# EAGLE design PIC18F44K22 KONTROL KART (EAGLE 9.6.2)
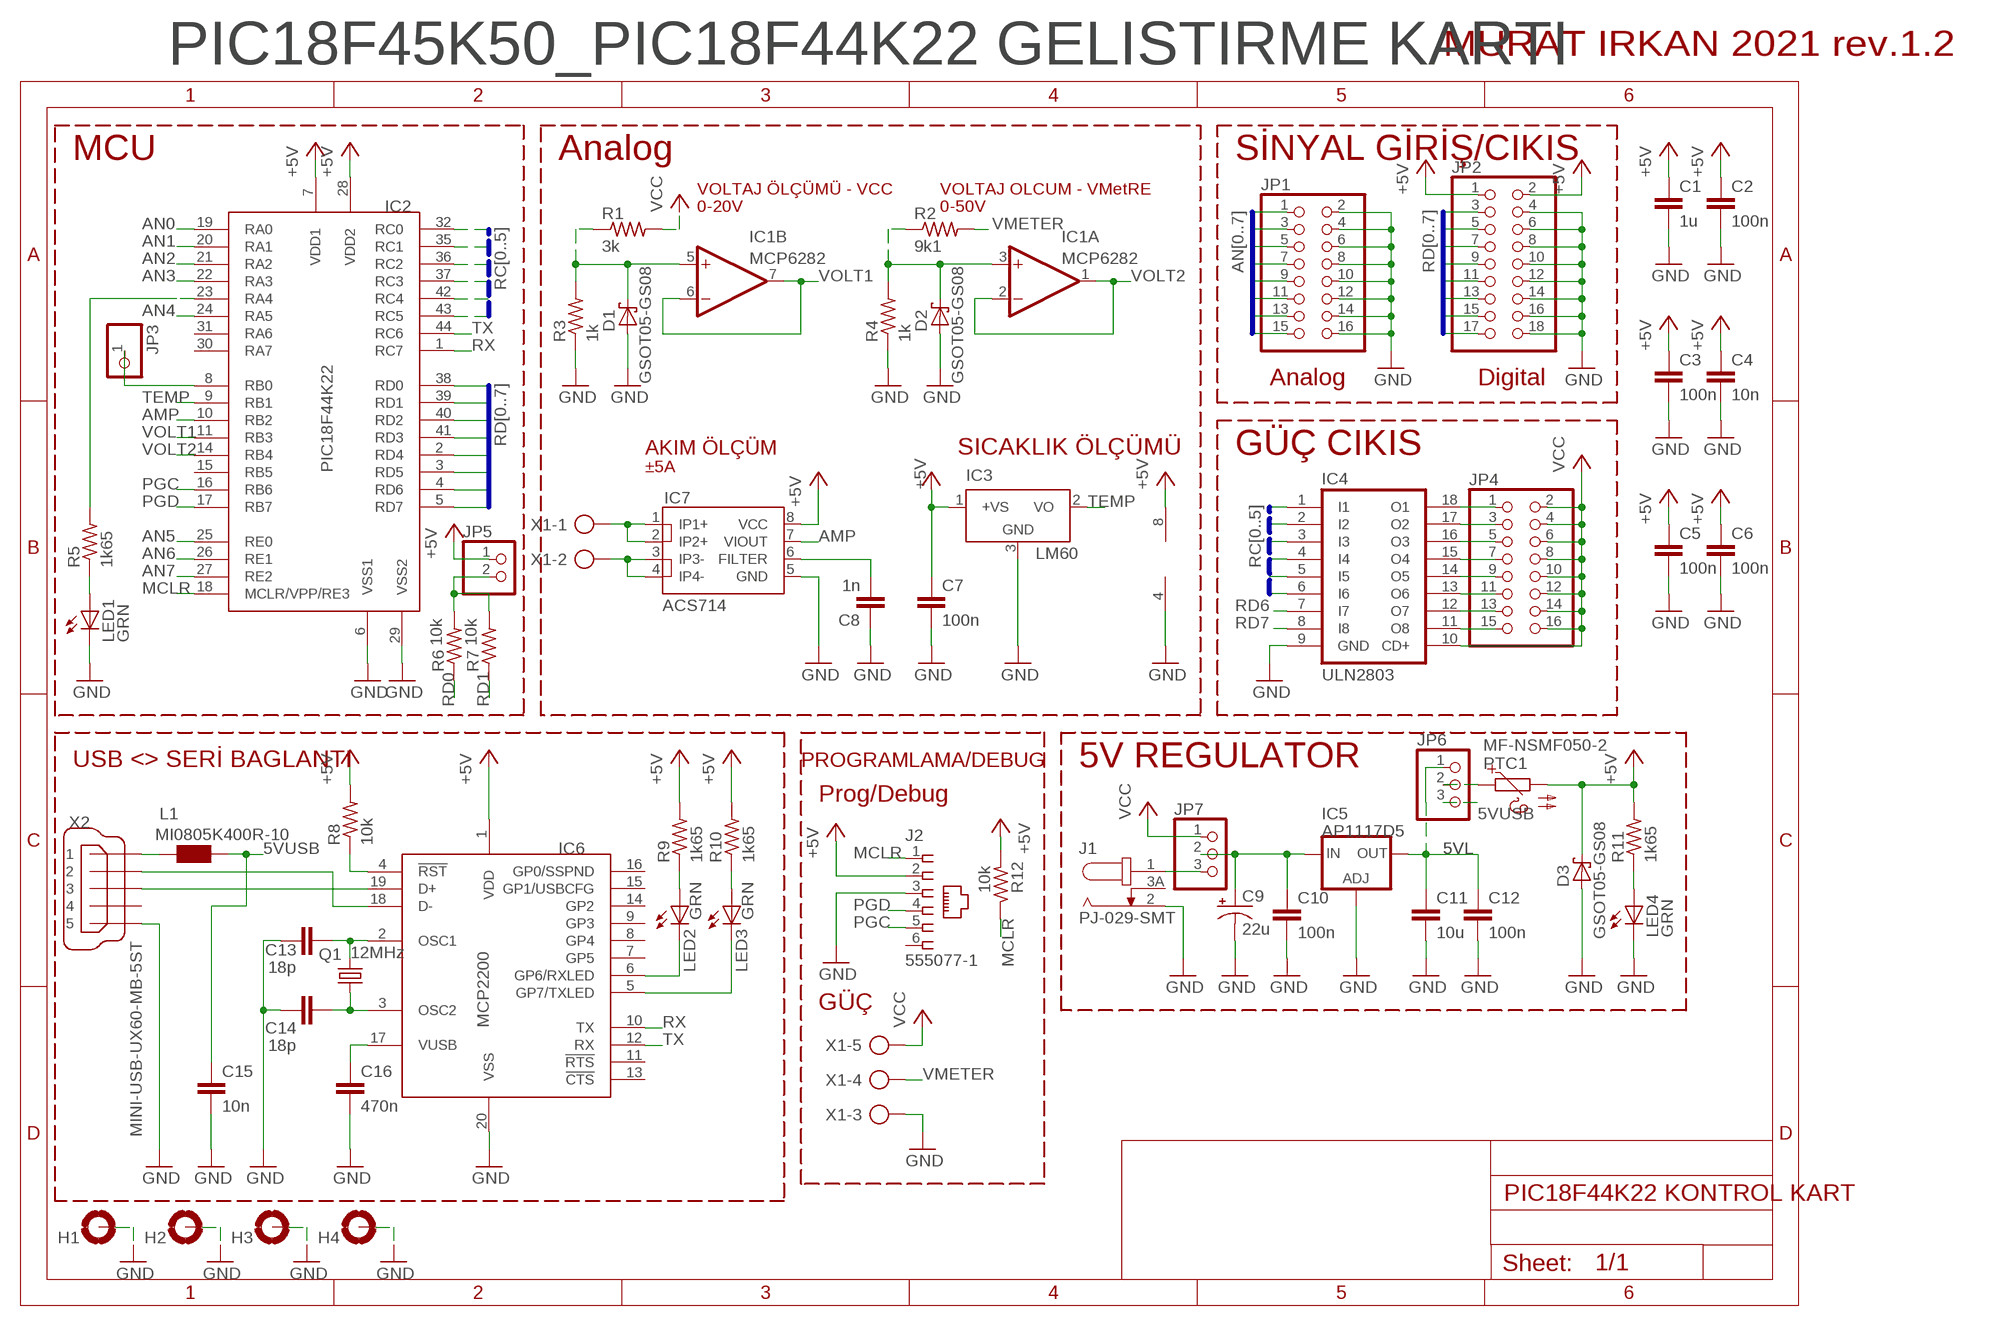
[diagram p0: schematic, sheet 1]

## Parts
C1  1u  C-EUC0603  [C0603]
C2  100n  C-EUC0603  [C0603]
C3  100n  C-EUC0603  [C0603]
C4  10n  C-EUC0603  [C0603]
C5  100n  C-EUC0603  [C0603]
C6  100n  C-EUC0603  [C0603]
C7  100n  C-EUC0603  [C0603]
C8  1n  C-EUC0603  [C0603]
C9  22u  CPOL-US153CLV-0505  [153CLV-0505]
C10  100n  C-EUC0603  [C0603]
C11  10u  C-EUC0805  [C0805]
C12  100n  C-EUC0603  [C0603]
C13  18p  C-EUC0603  [C0603]
C14  18p  C-EUC0603  [C0603]
C15  10n  C-EUC0603  [C0603]
C16  470n  C-EUC0603  [C0603]
D1  GSOT05-GS08  BAS70  [SOT23]
D2  GSOT05-GS08  BAS70  [SOT23]
D3  GSOT05-GS08  BAS70  [SOT23]
H1  MOUNT-PAD-ROUND3.2  [3,2-PAD]
H2  MOUNT-PAD-ROUND3.2  [3,2-PAD]
H3  MOUNT-PAD-ROUND3.2  [3,2-PAD]
H4  MOUNT-PAD-ROUND3.2  [3,2-PAD]
IC1  MCP6282  MCP602SN  [SO08]
IC2  PIC18F44K22  [TQFP44]
IC3  LM60  LM50  [SOT23]
IC4  ULN2803  [SO18]
IC5  AP1117D5  LD117ADT33TR  [DPACK]
IC6  MCP2200  [SSOP20]
IC7  ACS714  ACS712  [SO08]
J1  PJ-029-SMT  [SMT]
J2  555077-1  [555077-1]
JP1  PINHD-2X8  [2X08]
JP2  PINHD-2X9  [2X09]
JP3  PINHD-1X1  [1X01]
JP4  PINHD-2X8  [2X08]
JP5  PINHD-1X2  [1X02]
JP6  PINHD-1X3  [1X03]
JP7  PINHD-1X3  [1X03]
L1  MI0805K400R-10  WE-CBF_0805  [0805]
LED1  GRN  LEDCHIPLED_0603  [CHIPLED_0603]
LED2  GRN  LEDCHIPLED_0603  [CHIPLED_0603]
LED3  GRN  LEDCHIPLED_0603  [CHIPLED_0603]
LED4  GRN  LEDCHIPLED_0603  [CHIPLED_0603]
PTC1  MF-NSMF050-2  GENERIC_1206  [1206]
Q1  12MHz  CRYSTALHC49UP  [HC49UP]
R1  3k  R-US_R0603  [R0603]
R2  9k1  R-US_R0603  [R0603]
R3  1k  R-US_R0603  [R0603]
R4  1k  R-US_R0603  [R0603]
R5  1k65  R-US_R0603  [R0603]
R6  10k  R-US_R0603  [R0603]
R7  10k  R-US_R0603  [R0603]
R8  10k  R-US_R0603  [R0603]
R9  1k65  R-US_R0603  [R0603]
R10  1k65  R-US_R0603  [R0603]
R11  1k65  R-US_R0603  [R0603]
R12  10k  R-US_R0603  [R0603]
X1  OSTTE-5  [OSTTE-5]
X2  MINI-USB-UX60-MB-5ST  [UX60-MB-5ST]

## Nets
5VL: C11.1 C12.1 IC5.4(OUT) JP6.1
5VUSB: C15.1 JP6.3 L1.1
+5V: C1.1 C2.1 C3.1 C4.1 C5.1 C6.1 C7.1 D3.3(C) IC1.8(P:V+) IC2.7(VDD1) IC2.28(VDD2) IC3.1(+VS) IC6.1(VDD) IC7.8(VCC) J2.2 JP2.1 JP2.2 JP5.1 PTC1.2 R8.2 R9.2 R10.2 R11.2 R12.2
ALIVE: IC2.23(RA4) R5.2
AMP: IC2.10(RB2) IC7.7(VIOUT)
AN0: IC2.19(RA0) JP1.15
AN1: IC2.20(RA1) JP1.13
AN2: IC2.21(RA2) JP1.11
AN3: IC2.22(RA3) JP1.9
AN4: IC2.24(RA5) JP1.7
AN5: IC2.25(RE0) JP1.5
AN6: IC2.26(RE1) JP1.3
AN7: IC2.27(RE2) JP1.1
D+: IC6.19(D+) X2.3
D-: IC6.18(D-) X2.2
GND: C1.2 C2.2 C3.2 C4.2 C5.2 C6.2 C7.2 C8.1 C9.- C10.2 C11.2 C12.2 C13.1 C14.1 C15.2 C16.2 D1.1(A) D2.1(A) D3.1(A) H1.B3,2(MOUNT) H2.B3,2(MOUNT) H3.B3,2(MOUNT) H4.B3,2(MOUNT) IC1.4(P:V-) IC2.6(VSS1) IC2.29(VSS2) IC3.3(GND) IC4.9(GND) IC5.1(ADJ) IC6.20(VSS) IC7.5(GND) J1.2 J2.3 JP1.2 JP1.4 JP1.6 JP1.8 JP1.10 JP1.12 JP1.14 JP1.16 JP2.4 JP2.6 JP2.8 JP2.10 JP2.12 JP2.14 JP2.16 JP2.18 LED1.C LED4.C R3.1 R4.1 X1.3 X2.5
IS1: IC7.1(IP1+) IC7.2(IP2+) X1.1
IS2: IC7.3(IP3-) IC7.4(IP4-) X1.2
MCLR: IC2.18(MCLR/VPP/RE3) J2.1 R12.1
N$1: C13.2 IC6.2(OSC1) Q1.2
N$2: C14.2 IC6.3(OSC2) Q1.1
N$3: JP5.2 R6.2 R7.2
N$4: LED4.A R11.1
N$5: JP6.2 PTC1.1
N$6: LED1.A R5.1
N$7: L1.2 X2.1
N$8: C8.2 IC7.6(FILTER)
N$9: IC2.8(RB0) JP3.1
N$10: D1.3(C) IC1.5(B:+IN) R1.1 R3.2
N$12: C9.+ C10.1 IC5.3(IN) JP7.2
N$13: D2.3(C) IC1.3(A:+IN) R2.1 R4.2
N$15: IC6.4(!RST) R8.1
N$16: IC6.5(GP7/TXLED) LED3.C
N$17: IC6.6(GP6/RXLED) LED2.C
N$18: LED2.A R9.1
N$19: LED3.A R10.1
N$20: C16.1 IC6.17(VUSB)
N$72: J1.1 JP7.3
P0: IC4.13(O6) JP4.11
P1: IC4.14(O5) JP4.9
P2: IC4.15(O4) JP4.7
P3: IC4.16(O3) JP4.5
P4: IC4.17(O2) JP4.3
P5: IC4.18(O1) JP4.1
PD6: IC4.12(O7) JP4.13
PD7: IC4.11(O8) JP4.15
PGC: IC2.16(RB6) J2.5
PGD: IC2.17(RB7) J2.4
RC0: IC2.32(RC0) IC4.6(I6)
RC1: IC2.35(RC1) IC4.5(I5)
RC2: IC2.36(RC2) IC4.4(I4)
RC3: IC2.37(RC3) IC4.3(I3)
RC4: IC2.42(RC4) IC4.2(I2)
RC5: IC2.43(RC5) IC4.1(I1)
RD0: IC2.38(RD0) JP2.17 R6.1
RD1: IC2.39(RD1) JP2.15 R7.1
RD2: IC2.40(RD2) JP2.13
RD3: IC2.41(RD3) JP2.11
RD4: IC2.2(RD4) JP2.9
RD5: IC2.3(RD5) JP2.7
RD6: IC2.4(RD6) IC4.7(I7) JP2.5
RD7: IC2.5(RD7) IC4.8(I8) JP2.3
RX: IC2.1(RC7) IC6.10(TX)
TEMP: IC2.9(RB1) IC3.2(VO)
TX: IC2.44(RC6) IC6.12(RX)
VCC: IC4.10(CD+) JP4.2 JP4.4 JP4.6 JP4.8 JP4.10 JP4.12 JP4.14 JP4.16 JP7.1 R1.2 X1.5
VMETER: R2.2 X1.4
VOLT1: IC1.6(B:-IN) IC1.7(B:OUT) IC2.11(RB3)
VOLT2: IC1.1(A:OUT) IC1.2(A:-IN) IC2.14(RB4)
Unconnected: IC2.15(RB5) IC2.30(RA7) IC2.31(RA6) IC6.7(GP5) IC6.8(GP4) IC6.9(GP3) IC6.11(!RTS) IC6.13(!CTS) IC6.14(GP2) IC6.15(GP1/USBCFG) IC6.16(GP0/SSPND) J1.3A J2.6 X2.4

## Buses
RC[0..5]
RD[0..7]
AN[0..7]

## Notes on the sheet
- PIC18F45K50_PIC18F44K22 GELISTIRME KARTI | MURAT IRKAN 2021 rev.1.2
- MCU | Analog | SİNYAL GİRİŞ/CIKIS
- VOLTAJ ÖLÇÜMÜ - VCC | VOLTAJ OLCUM - VMetRE
- 0-20V | 0-50V
- Analog | Digital
- AKIM ÖLÇÜM | SICAKLIK ÖLÇÜMÜ | GÜÇ CIKIS
- ±5A
- USB <> SERİ BAGLANTI | PROGRAMLAMA/DEBUG | 5V REGULATOR
- Prog/Debug
- GÜÇ

## Library data of the parts
C1-C8 C10-C16 = rcl:C-EU: CAPACITOR, European symbol
C9 = rcl:CPOL-US: POLARIZED CAPACITOR, American symbol
D1-D3 = diode:BAS70: Silicon Schottky Diodes General-purpose diode for high-speed switching
H1-H4 = holes:MOUNT-PAD-ROUND: MOUNTING PAD, round
IC1 = linear:MCP602: Single Op Amp 2.7V to 6.0V Single Supply CMOS Source: http://ww1.microchip.com/downloads/en/DeviceDoc/21314g.pdf
IC2 = microchip-18f44k22:PIC18F44K22
IC3 = linear:LM50: SOT-23 Single-Supply Centigrade Temperature Sensor Vout = (10mV/°C x Temp °C) +5mmmV Source: http://cache.national.com/ds/LM/LM50.pdf
IC4 = jfduval:ULN2803
IC5 = v-reg:LD117A?*: Low drop fixed and adjustable positive voltage regulators 1 A Source: http://www.st.com/stonline/products/literature/ds/7194/ld1117axx.pdf
IC6 = mcp2200-2:MCP2200
IC7 = Drive Comp:ACS712: http://www.allegromicro.com/en/Products/Part_Numbers/0712/
J1 = con-jack:PJ-029-SMT
J2 = con-amp:555077-1: AMP connector
JP1 JP4 = pinhead:PINHD-2X8: PIN HEADER
JP2 = pinhead:PINHD-2X9: PIN HEADER
JP3 = pinhead:PINHD-1X1: PIN HEADER
JP5 = pinhead:PINHD-1X2: PIN HEADER
JP6 JP7 = pinhead:PINHD-1X3: PIN HEADER
L1 = wuerth-elektronik:WE-CBF: SMD EMI Suppression Ferrite Beads - excellent anti-EMI properties - low DCR - impedances till 3000 ohms - rated current up to 6 A
LED1-LED4 = led:LED: LED OSRAM: - CHIPLED LG R971, LG N971, LY N971, LG Q971, LY Q971, LO R971, LY R971 LH N974, LH R974 LS Q976, LO Q976, LY Q976 LO Q996 - Hyper CHIPLED LW Q18S LB Q993, LB Q99A, LB R99A - SideLED LS A670, LO A670, LY A670, LG A670, LP A670 LB A673, LV A673, LT A673, LW A673 LH A674 LY A675 LS A676, LA A676, LO A676, LY A676, LW A676 LS A679, LY A679, LG A679 - Hyper Micro SIDELED® LS Y876, LA Y876, LO Y876, LY Y876 LT Y87S - SmartLED LW L88C, LW L88S LB L89C, LB L89S, LG L890 LS L89K, LO L89K, LY L89K LS L896, LA L896, LO L896, LY L896 - TOPLED LS T670, LO T670, LY T670, LG T670, LP T670 LSG T670, LSP T670, LSY T670, LOP T670, LYG T670 LG T671, LOG T671, LSG T671 LB T673, LV T673, LT T673, LW T673 LH T674 LS T676, LA T676, LO T676, LY T676, LB T676, LH T676, LSB T676, LW T676 LB T67C, LV T67C, LT T67C, LS T67K, LO T67K, LY T67K, LW E67C LS E67B, LA E67B, LO E67B, LY E67B, LB E67C, LV E67C, LT E67C LW T67C LS T679, LY T679, LG T679 LS T770, LO T770, LY T770, LG T770, LP T770 LB T773, LV T773, LT T773, LW T773 LH T774 LS E675, LA E675, LY E675, LS T675 LS T776, LA T776, LO T776, LY T776, LB T776 LHGB T686 LT T68C, LB T68C - Hyper Mini TOPLED® LB M676 - Mini TOPLED Santana® LG M470 LS M47K, LO M47K, LY M47K Source: http://www.osram.convergy.de LUXEON: - LUMILED® LXK2-PW12-R00, LXK2-PW12-S00, LXK2-PW14-U00, LXK2-PW14-V00 LXK2-PM12-R00, LXK2-PM12-S00, LXK2-PM14-U00 LXK2-PE12-Q00, LXK2-PE12-R00, LXK2-PE12-S00, LXK2-PE14-T00, LXK2-PE14-U00 LXK2-PB12-K00, LXK2-PB12-L00, LXK2-PB12-M00, LXK2-PB14-N00, LXK2-PB14-P00, LXK2-PB14-Q00 LXK2-PR12-L00, LXK2-PR12-M00, LXK2-PR14-Q00, LXK2-PR14-R00 LXK2-PD12-Q00, LXK2-PD12-R00, LXK2-PD12-S00 LXK2-PH12-R00, LXK2-PH12-S00 LXK2-PL12-P00, LXK2-PL12-Q00, LXK2-PL12-R00 Source: www.luxeon.com KINGBRIGHT: KA-3528ASYC Source: www.kingbright.com
PTC1 = ptc-ntc:GENERIC_1206
Q1 = crystal:CRYSTAL: CRYSTAL
R1-R12 = rcl:R-US_: RESISTOR, American symbol
X1 = con-terminal-ostte:OSTTE-5
X2 = con-hirose2:MINI-USB-: MINI USB Connector Source: http://www.hirose.co.jp/cataloge_hp/e24000019.pdf

## Net classes
0 default: width 0.152 mm, drill 0.381 mm, clearance 0.152 mm

## Board
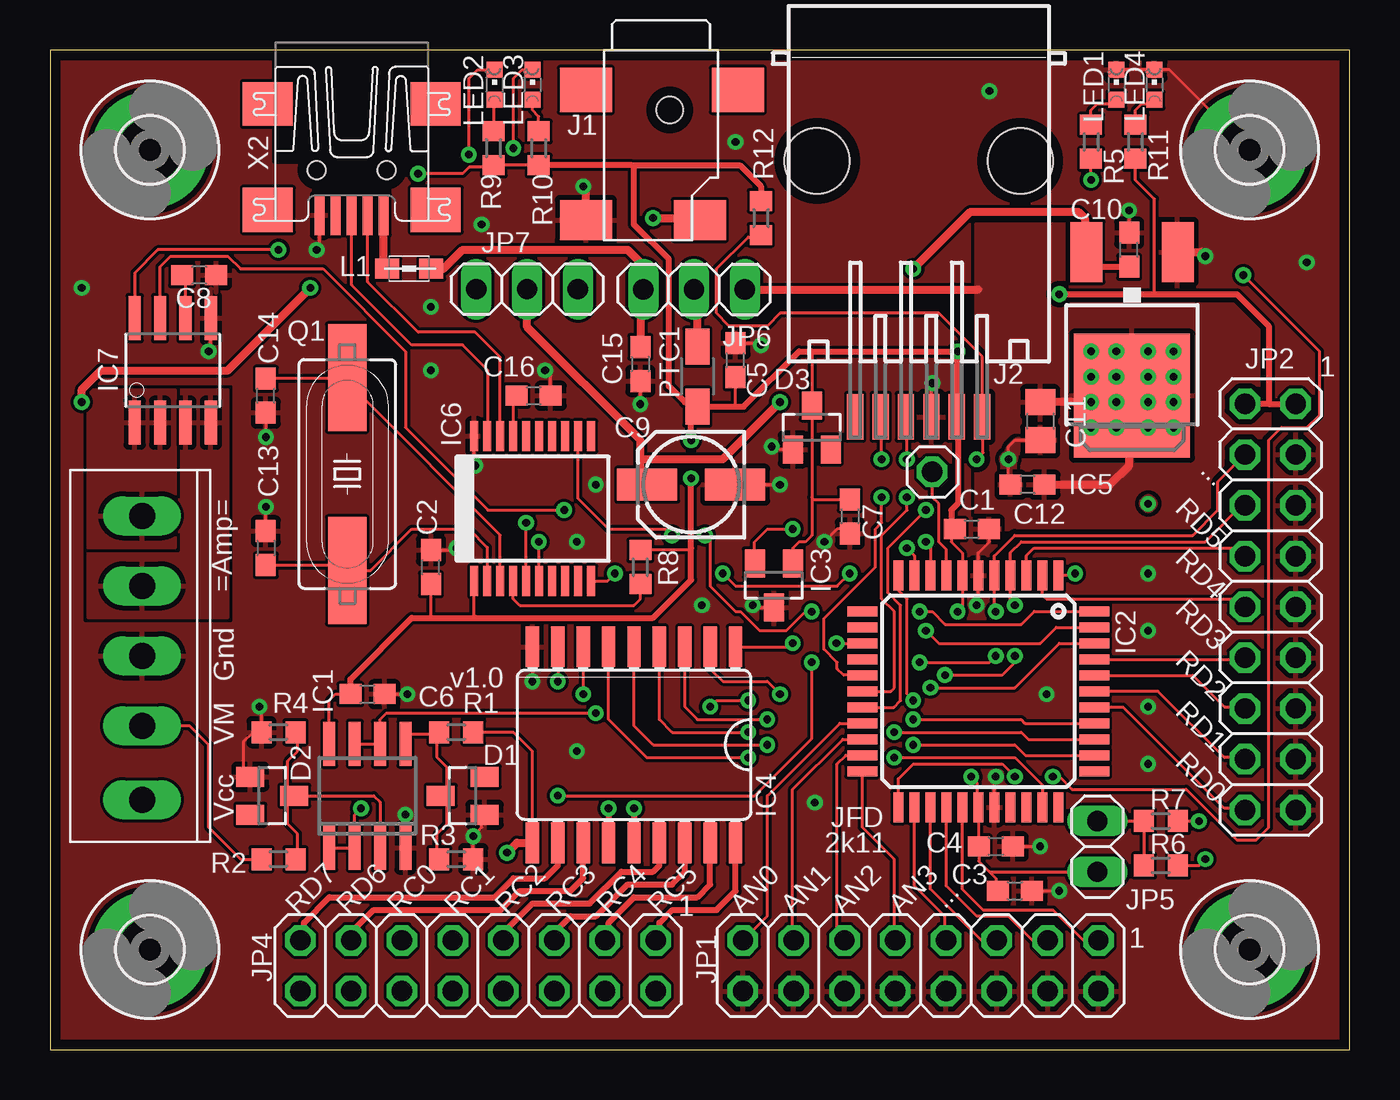
[diagram p1: board, top side]
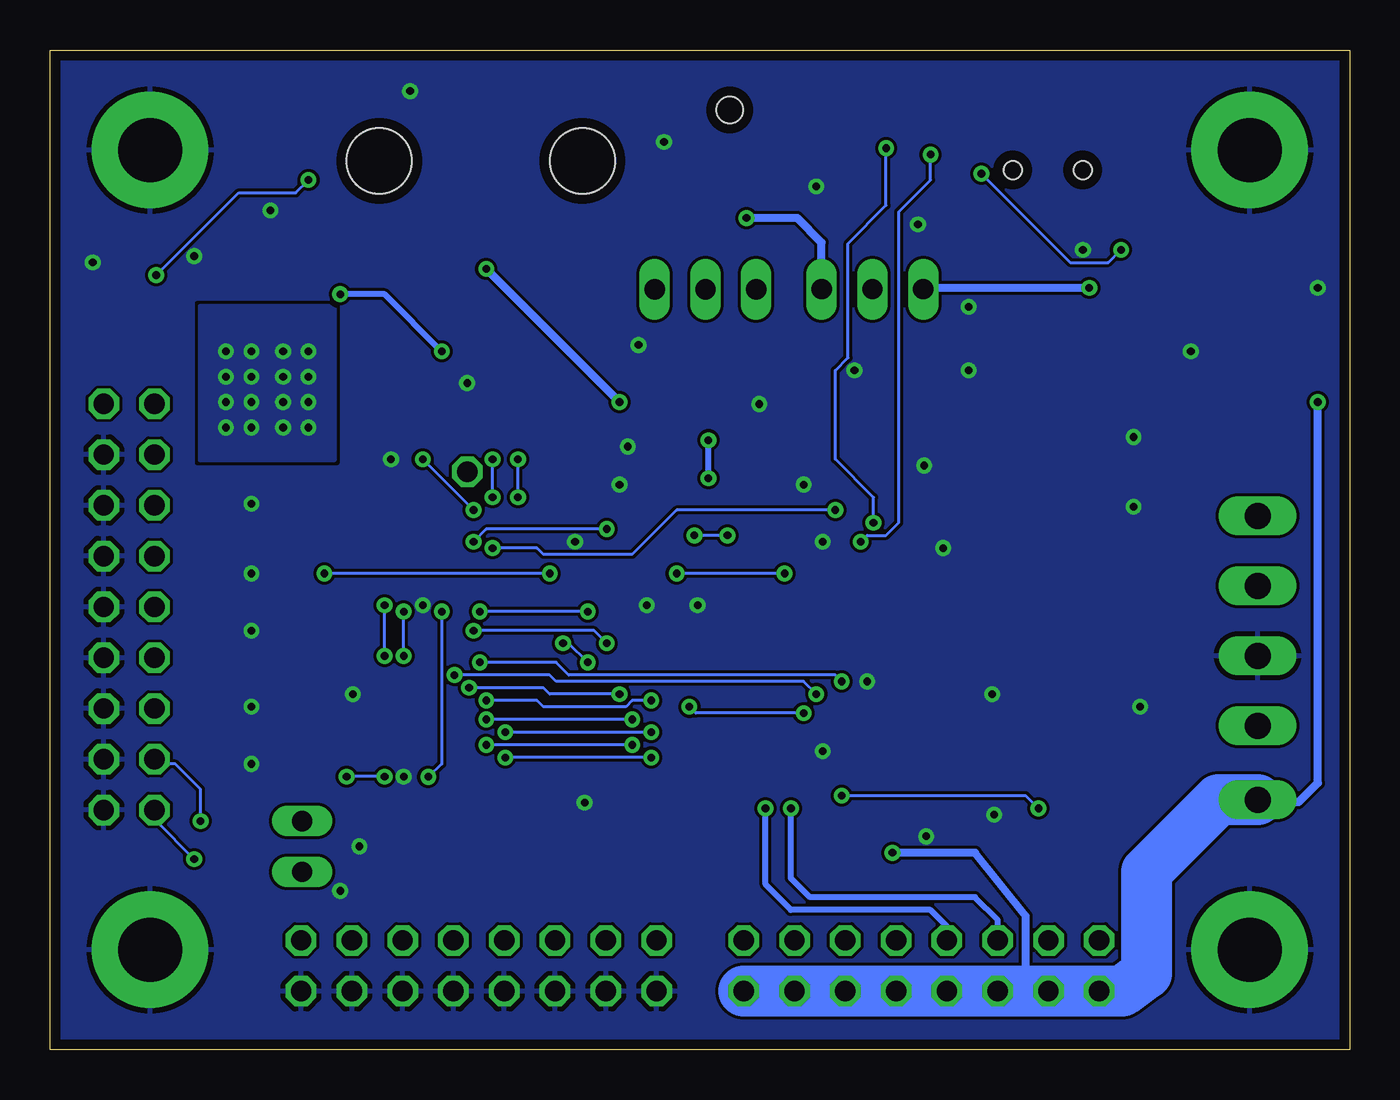
[diagram p2: board, bottom side, seen from below]

Size 65 x 50 mm. Coordinates in mm from the lower left corner, seen from the top.
Outline: 0,0 65,0 65,50 0,50 0,0
Copper layers (1+16): Top 0.0356mm / dielectric 1.5011mm / Bottom 0.0356mm
Design rules "4pcb-2l": minimum track width 6mil, minimum drill 15mil, track to track 6mil, track to pad 6mil, pad to pad 6mil, via to via 6mil, smd to smd 6mil, copper to edge 20mil, drill to drill 10mil, minimum pad ring 10mil, minimum via ring 8mil, stop-mask expansion 4mil, vias tented up to drill 0mil, thermal gap 10mil

### Footprints (pad centres in the part's own frame; a part is rotated, then mirrored left to right if it is on the bottom)
C0603 = smd 1.1 x 1: 1 -0.85,0; 2 0.85,0
153CLV-0505 = smd 3 x 1.6: + 2.2,0; - -2.2,0
C0805 = smd 1.3 x 1.5: 1 -0.95,0; 2 0.95,0
SOT23 = smd 1 x 1.4: 1 -0.95,-1.1; 2 0.95,-1.1; 3 0,1.1
3,2-PAD = drill 3.2 pad 5.842: B3,2 0,0
SO08 = smd 0.6 x 2.2: 1 -1.905,-2.6; 2 -0.635,-2.6; 3 0.635,-2.6; 4 1.905,-2.6; 5 1.905,2.6; 6 0.635,2.6; 7 -0.635,2.6; 8 -1.905,2.6
TQFP44 = smd 1.5 x 0.5: 1 -5.77,4.08; 2 -5.77,3.28; 3 -5.77,2.48; 4 -5.77,1.68; 5 -5.77,0.88; 6 -5.77,0.08; 7 -5.77,-0.72; 8 -5.77,-1.52; 9 -5.77,-2.32; 10 -5.77,-3.12; 11 -5.77,-3.92; 23 5.83,-3.92; 24 5.83,-3.12; 25 5.83,-2.32; 26 5.83,-1.52; 27 5.83,-0.72; 28 5.83,0.08; 29 5.83,0.88; 30 5.83,1.68; 31 5.83,2.48; 32 5.83,3.28; 33 5.83,4.08 | smd 0.5 x 1.5: 12 -3.97,-5.72; 13 -3.17,-5.72; 14 -2.37,-5.72; 15 -1.57,-5.72; 16 -0.77,-5.72; 17 0.03,-5.72; 18 0.83,-5.72; 19 1.63,-5.72; 20 2.43,-5.72; 21 3.23,-5.72; 22 4.03,-5.72; 34 4.03,5.88; 35 3.23,5.88; 36 2.43,5.88; 37 1.63,5.88; 38 0.83,5.88; 39 0.03,5.88; 40 -0.77,5.88; 41 -1.57,5.88; 42 -2.37,5.88; 43 -3.17,5.88; 44 -3.97,5.88
SO18 = smd 0.66 x 2.032: 1 -5.08,-4.902; 2 -3.81,-4.902; 3 -2.54,-4.902; 4 -1.27,-4.902; 5 0,-4.902; 6 1.27,-4.902; 7 2.54,-4.902; 8 3.81,-4.902; 9 5.08,-4.902; 10 5.08,4.902; 11 3.81,4.902; 12 2.54,4.902; 13 1.27,4.902; 14 0,4.902; 15 -1.27,4.902; 16 -2.54,4.902; 17 -3.81,4.902; 18 -5.08,4.902
DPACK = smd 1.6 x 3: 1 -2.28,-4.8; 3 2.28,-4.8 | smd 5.8 x 6.2: 4 0,2.38
SSOP20 = smd 0.4 x 1.5: 1 -2.685,-3.065; 2 -2.035,-3.065; 3 -1.385,-3.065; 4 -0.735,-3.065; 5 -0.085,-3.065; 6 0.565,-3.065; 7 1.215,-3.065; 8 1.865,-3.065; 9 2.515,-3.065; 10 3.165,-3.065; 11 3.165,4.185; 12 2.515,4.185; 13 1.865,4.185; 14 1.215,4.185; 15 0.565,4.185; 16 -0.085,4.185; 17 -0.735,4.185; 18 -1.385,4.185; 19 -2.035,4.185; 20 -2.685,4.185
SO08' = smd 0.61 x 2.21: 1 -1.905,-2.616; 2 -0.635,-2.616; 3 0.635,-2.616; 4 1.905,-2.616; 5 1.905,2.616; 6 0.635,2.616; 7 -0.635,2.616; 8 -1.905,2.616
SMT = smd 2 x 2.6: 1 5.5,1.5; 2 5.5,-4.2 | smd 2.2 x 2.6: 3A -1,-4.2; 3B -1,3.4 | hole 1.321: 0,0
555077-1 = smd 0.813 x 2.286: 1 -3.175,12.803; 2 -1.905,12.803; 3 -0.635,12.803; 4 0.635,12.803; 5 1.905,12.803; 6 3.175,12.803 | hole 3.251: -5.08,0; 5.08,0
2X08 = drill 1.016 octagon: 1 -8.89,-1.27; 2 -8.89,1.27; 3 -6.35,-1.27; 4 -6.35,1.27; 5 -3.81,-1.27; 6 -3.81,1.27; 7 -1.27,-1.27; 8 -1.27,1.27; 9 1.27,-1.27; 10 1.27,1.27; 11 3.81,-1.27; 12 3.81,1.27; 13 6.35,-1.27; 14 6.35,1.27; 15 8.89,-1.27; 16 8.89,1.27
2X09 = drill 1.016 octagon: 1 -10.16,-1.27; 2 -10.16,1.27; 3 -7.62,-1.27; 4 -7.62,1.27; 5 -5.08,-1.27; 6 -5.08,1.27; 7 -2.54,-1.27; 8 -2.54,1.27; 9 0,-1.27; 10 0,1.27; 11 2.54,-1.27; 12 2.54,1.27; 13 5.08,-1.27; 14 5.08,1.27; 15 7.62,-1.27; 16 7.62,1.27; 17 10.16,-1.27; 18 10.16,1.27
1X01 = drill 1.016 octagon: 1 0,0
1X02 = drill 1.016 long: 1 -1.27,0; 2 1.27,0
1X03 = drill 1.016 long: 1 -2.54,0; 2 0,0; 3 2.54,0
0805 = smd 1.2 x 1: 1 -1.1,0; 2 1.1,0
CHIPLED_0603 = smd 0.8 x 0.8: A 0,-0.75; C 0,0.75
1206 = smd 1.8 x 1.2: 1 -1.499,0; 2 1.499,0
HC49UP = smd 5.334 x 1.93: 1 -4.826,0; 2 4.826,0
R0603 = smd 1 x 1.1: 1 -0.85,0; 2 0.85,0
OSTTE-5 = drill 1.3 long: 1 2.3,3.6; 2 5.8,3.6; 3 9.3,3.6; 4 12.8,3.6; 5 16.51,3.6
UX60-MB-5ST = smd 2 x 0.5: 1 2.25,1.6; 2 2.25,0.8; 3 2.25,0; 4 2.25,-0.8; 5 2.25,-1.6 | smd 2.2 x 2.5: M1 -3.3,-4.2; M2 -3.3,4.2; M3 2,4.2; M4 2,-4.2 | hole 0.9: 0,-1.75; 0,1.75

### Placement (x,y rotation side)
C1  46.1,26.04 0 top
C2  19.05,24.13 90 top
C3  48.26,7.94 0 top
C4  47.31,10.16 0 top
C5  34.29,34.48 90 top
C6  15.88,17.78 0 top
C7  40.01,26.67 270 top
C8  7.46,38.73 180 top
C9  32.07,28.26 180 top
C10  53.98,40.01 90 top
C11  49.53,31.43 270 top
C12  48.9,28.26 180 top
C13  10.79,25.08 270 top
C14  10.79,32.7 90 top
C15  29.53,34.29 270 top
C16  24.19,32.7 0 top
D1  20.64,12.7 90 top
D2  11.11,12.7 270 top
D3  38.1,31.11 0 top
H1  5,5 0 top
H2  60,5 0 top
H3  5,45 0 top
H4  60,45 0 top
IC1  15.88,12.7 0 top
IC2  46.35,17.95 270 top
IC3  36.2,23.23 180 top
IC4  29.21,15.24 180 top
IC5  54.12,35.09 180 top
IC6  23.91,26.5 0 top
IC7  ACS714  [SO08']  6.14,33.97 0 top
J1  31,47 270 top
J2  43.45,44.45 180 top
JP1  43.55,4.19 180 top
JP2  61.04,22.14 270 top
JP3  44.13,28.89 0 top
JP4  21.41,4.19 180 top
JP5  52.39,10.16 90 top
JP6  32.22,38.02 180 top
JP7  23.86,38.03 0 top
L1  17.97,39.05 180 top
LED1  53.34,48.26 0 top
LED2  22.23,48.26 0 top
LED3  24.13,48.26 0 top
LED4  55.24,48.26 0 top
PTC1  32.38,33.66 270 top
Q1  14.87,28.79 270 top
R1  20.32,15.88 0 top
R2  11.43,9.53 180 top
R3  20.32,9.53 180 top
R4  11.43,15.88 0 top
R5  52.07,45.4 270 top
R6  55.56,9.21 180 top
R7  55.56,11.43 180 top
R8  29.53,24.13 90 top
R9  22.19,45.09 270 top
R10  24.45,45.09 270 top
R11  54.29,45.4 270 top
R12  35.56,41.59 90 top
X1  1,29 270 top
X2  15.1,44 270 top

### Tracks (layer width: path | path; a pad name or v marks a point on that pad's centre or on a via)
5VL  (via drill 0.38)
  Top 0.406: JP6.1 46.44,38.02 | 51.44,33.02 53.81,33.02 IC5.4 | C11.1 53.79,32.38 IC5.4 | C12.1 53.02,28.26 53.98,29.21 53.98,32.56 IC5.4
  other vias: 53.34,34.92 54.93,34.92 52.07,34.92 56.2,34.92 53.34,33.66 54.93,33.66 56.2,33.66 52.07,33.66 53.34,32.38 52.07,32.38 54.93,32.38 56.2,32.38 56.2,31.11 54.93,31.11 53.34,31.11 52.07,31.11
  pour Top (isolate 0.254, rank 2): 46.35,41.27 60.96,41.27 60.96,26.04 46.35,26.04
  pour Bottom (isolate 0.305): 50.8,37.15 57.47,37.15 57.47,29.53 50.8,29.53
5VUSB
  Top 0.406: L1.1 19.68,39.05 20.64,40.01 28.89,40.01 29.53,39.37 29.53,38.17 | 29.53,38.17 C15.1 | 29.53,38.17 JP6.3
+5V  (via drill 0.38)
  Top 0.152: IC1.8 13.97,17.46 14.29,17.78 C6.1 | C1.1 45.09,25.93 45.09,25.4 45.63,24.85 IC2.7 45.63,22.14 v45.4,21.91 | IC7.8 4.24,38.84 5.4,40.01 v11.43,40.01 | v18.41,43.81 20.64,43.81 20.95,44.13 22.12,44.13 R9.2 R10.2 | v46.08,13.64 46.35,13.34 46.35,12.21 IC2.28 46.44,10.18 C4.1 46.46,9.42 46.99,8.89 | 46.99,8.89 47.31,8.57 47.31,8.04 C3.1 | 34.29,32.16 C5.1 | IC6.1 21.22,21.64 21.27,21.59 | 19.05,21.59 C2.1 | 46.99,8.89 JP5.1 | R11.2 54.29,43.5 55.24,42.55 55.24,37.78 | IC3.1 37.15,25.09 37.47,25.4 37.78,25.4 38.1,25.72 38.1,27.62 | 39.9,27.62 C7.1 38.2,27.52 38.1,27.62 | 38.1,27.62 D3.3 38.1,34.92 | R8.2 31.96,24.98 32.07,25.08
  Top 0.305: C6.1 15.03,18.52 18.1,21.59 19.05,21.59 21.27,21.59 30.16,21.59 32.07,23.5 32.07,25.08 v32.07,28.57 | PTC1.2 34.29,32.16 34.7,32.16 37.47,34.92 38.1,34.92 v45.4,34.92 45.35,34.88 J2.2 45.4,31.6 45.4,27.3 45.09,26.99 45.09,26.14 C1.1 | 60.96,32.3 JP2.1 | 60.96,32.3 JP2.2 | 60.96,32.3 60.96,36.2 59.37,37.78 55.24,37.78 v50.48,37.78 | 29.21,44.13 29.21,41.27 30.96,39.53 30.96,33.18 31.75,32.38 32.16,32.38 PTC1.2 | R10.2 29.11,44.23 29.21,44.13 | R12.2 35.56,43.18 34.51,44.23 29.21,44.23 29.21,44.13 | v32.07,30.48 32.07,31.84 PTC1.2
  Bottom 0.152: v45.4,21.91 45.4,14.29 v46.08,13.64 | v18.41,43.81 13.97,39.37 12.06,39.37 v11.43,40.01
  Bottom 0.305: v45.4,34.92 48.26,37.78 v50.48,37.78 | v32.07,28.57 v32.07,30.48
ALIVE  (via drill 0.38)
  Top 0.152: IC2.23 42.44,13.54 43.18,14.29 47.62,14.29 v48.26,13.65 | v50.16,13.65 50.48,13.65 51.12,13.02 56.83,13.02 59.37,10.48 60.33,10.48 60.96,11.11 60.96,30.48 61.59,31.11 62.87,31.11 63.5,31.75 63.5,34.92 v59.69,38.73 | v52.07,43.5 R5.2
  Bottom 0.152: v48.26,13.65 v50.16,13.65 | v59.69,38.73 55.56,42.86 52.7,42.86 v52.07,43.5
AMP  (via drill 0.38)
  Top 0.152: IC2.10 43.23,24.71 v42.86,25.08 | IC7.7 5.51,39.16 6.03,39.69 8.89,39.69 9.53,39.05 13.65,39.05 17.78,34.92 17.78,31.11 21.91,26.99 v25.72,26.99
  Bottom 0.152: v42.86,25.08 40.64,25.08 40.32,24.77 35.88,24.77 33.66,26.99 v25.72,26.99
AN0
  Top 0.152: IC2.19 39.5,16.32 35.88,12.7 35.88,6.68 JP1.15
AN1
  Top 0.152: IC2.20 39.66,15.53 37.15,13.02 37.15,5.51 JP1.13
AN2
  Top 0.152: IC2.21 39.81,14.72 39.37,14.29 39.37,5.71 39.69,5.4 39.69,5.51 JP1.11
AN3
  Top 0.152: IC2.22 40.63,11.12 42.23,9.53 42.23,5.51 JP1.9
AN4
  Top 0.152: IC2.24 43.23,8.2 44.77,6.67 44.77,5.51 JP1.7
AN5
  Top 0.152: 47.31,5.51 JP1.5 47.3,5.4 46.67,5.4 44.03,8.04 IC2.25
AN6
  Top 0.152: 49.85,5.51 JP1.3 49.84,5.4 49.21,5.4 47.94,6.67 46.35,6.67 44.84,8.19 IC2.26
AN7
  Top 0.152: 52.39,5.51 JP1.1 52.38,5.4 51.75,5.4 50.16,6.99 46.67,6.99 45.63,8.02 IC2.27
D+
  Top 0.152: X2.3 15.1,38.24 18.1,35.24 20.64,35.24 21.91,33.97 21.91,30.71 IC6.19
D-
  Top 0.152: X2.2 15.89,38.4 18.41,35.88 21.27,35.88 22.52,34.63 IC6.18
GND  (via drill 0.38)
  Top 0.152: IC7.5 8.05,35.03 v7.94,34.92 | C8.1 8.05,38.64 | IC6.20 21.22,29.26 v21.27,29.21 | IC4.9 v24.13,18.41 | IC2.29 47.23,13.58 v47.31,13.65 | v46.35,22.23 46.44,22.3 IC2.6 46.44,24.84 46.99,25.4 46.99,25.93 C1.2 | C6.2 v17.88,17.78 | v10.48,17.14 10.58,17.04 R4.1 10.16,15.88 9.7,15.41 9.7,13.97 D2.1 | IC1.4 v17.78,11.75 | R3.1 v21.17,10.66 v21.18,10.67 21.18,10.7 21.59,11.11 21.59,11.6 D1.1 | LED1.C LED4.C 55.99,49.01 H4.B3,2 | C13.1 v10.79,27.15 | C14.1 v10.79,30.64 | C4.2 v49.53,10.16 | C3.2 v50.48,7.94 | C2.2 20.22,24.98 v20.32,25.08 | C10.2 v53.98,41.97 | D3.1 36.28,30.02 v36.1,30.16 | C11.2 48.26,30.48 47.94,30.16 v47.94,29.53 47.94,28.36 C12.2 | C5.2 35.41,35.33 v35.56,35.24 | v29.53,32.29 C15.2 | X2.5 13.49,40.16 v13.34,40.01 | C9.- v36.51,28.26 | C16.2 25.04,33.69 v24.77,33.97 | J2.3 44.09,33.29 v44.13,33.34 | IC3.3 35.25,22.12 v35.15,22.23 | v38.73,25.4 39.37,26.04 39.79,26.04 C7.2
  Top 0.406: J1.2 26.8,43.05 v26.67,43.18 | IC5.1 57.58,39.89 v57.78,39.69
  other vias: 19.05,37.15 19.05,33.97 26.35,25.4 54.93,23.81 54.93,20.95 54.93,17.14 54.93,14.29 49.85,17.78 26.35,14.92 27.3,28.26 21.59,41.27 34.29,45.4 46.99,47.94 62.87,39.37 1.59,38.1 54.93,27.3 38.26,12.35 32.61,22.23
  pour Top (isolate 0.152, rank 4): 0,50.16 65.09,50.16 65.09,0 0,0
  pour Bottom (isolate 0.152, rank 2): 0,50.16 65.09,50.16 65.09,0 0,0
IS1
  pour Top (rank 2): 1.91,33.02 6.25,33.02 6.25,25.08 1.91,25.08
IS2
  pour Top (rank 3): 1.91,33.02 8.89,33.02 8.89,21.59 1.91,21.59
MCLR  (via drill 0.38)
  Top 0.152: IC2.18 42.21,17.12 42.55,17.46 42.55,22.23 41.91,22.86 41.91,25.08 v43.81,26.99 | v46.35,29.53 46.67,29.84 46.67,31.6 J2.1 46.62,34.66 44.45,36.83 36.51,36.83 35.88,36.2 33.97,36.2 33.34,36.83 33.34,39.05 34.92,40.64 35.46,40.64 R12.1
  Bottom 0.152: v43.81,26.99 v46.35,29.53
N$1
  Top 0.152: C13.2 14.6,24.23 Q1.2 16.03,23.96 18.1,26.04 20.95,26.04 21.87,25.12 IC6.2
N$2
  Top 0.152: C14.2 14.81,33.55 Q1.1 15.56,32.93 15.56,32.7 22.52,25.74 IC6.3
N$3
  Top 0.152: R6.2 R7.2 JP5.2
N$4
  Top 0.152: R11.1 54.29,46.99 54.61,47.31 55.04,47.31 LED4.A
N$5
  Top 0.406: PTC1.1 32.38,37.85 JP6.2
N$6
  Top 0.152: R5.1 52.07,46.99 52.39,47.31 53.14,47.31 LED1.A
N$7
  Top 0.406: X2.1 16.7,39.07 L1.2
N$8
  Top 0.152: IC7.6 6.78,38.61 C8.2
N$9
  Top 0.152: JP3.1 44.13,27.62 44.45,27.3 44.45,25.4 44.84,25.02 IC2.8
N$10
  Top 0.152: R3.2 19.37,9.63 19.37,10.79 19.86,11.28 19.86,12.38 D1.3 19.86,13.02 19.86,14.12 19.37,14.61 19.37,15.77 | 19.37,15.77 R1.1 | 19.37,15.77 17.78,15.77 | 17.78,15.77 17.78,15.88 | 17.78,15.77 IC1.5
N$12  (via drill 0.38)
  Top 0.305: 51.75,39.98 IC5.3 52.07,39.66 52.07,39.05 52.17,39.16 C10.1 | C9.+ 29.53,28.6 29.53,28.26 C9.+
  Top 0.406: JP7.2 23.86,36.15 29.53,30.48 29.53,29.53 | 29.53,28.6 29.53,29.53 | v43.18,39.05 46.04,41.91 51.44,41.91 51.75,41.59 51.75,39.98 | v36.51,32.38 33.66,29.53 29.53,29.53
  Bottom 0.406: v36.51,32.38 v43.18,39.05
N$13
  Top 0.152: R4.2 12.38,15.77 12.38,14.92 11.89,14.44 11.89,13.02 D2.3 | R2.1 12.38,9.63 12.38,10.79 11.89,11.28 11.89,12.38 D2.3 | IC1.3 16.51,12.38 16.19,12.7 D2.3
N$15
  Top 0.152: IC6.4 23.17,22.55 23.5,22.23 29.21,22.23 29.53,22.54 R8.1
N$16  (via drill 0.38)
  Top 0.152: LED3.C 23.61,49.01 23.18,48.58 v23.18,45.09 | v23.81,26.35 IC6.5
  Bottom 0.152: v23.18,45.09 23.18,42.23 25.08,40.32 25.08,34.61 25.72,33.97 25.72,29.53 23.81,27.62 v23.81,26.35
N$17  (via drill 0.38)
  Top 0.152: LED2.C 21.39,49.01 20.95,48.58 v20.95,44.77 | IC6.6 24.47,25.38 v24.45,25.4
  Bottom 0.152: v20.95,44.77 20.95,43.5 22.54,41.91 22.54,26.35 23.18,25.72 24.13,25.72 v24.45,25.4
N$18
  Top 0.152: R9.1 LED2.A
N$19
  Top 0.152: LED3.A 24.13,46.99 24.45,46.67 R10.1
N$20
  Top 0.152: IC6.17 23.17,32.59 C16.1
N$72  (via drill 0.38)
  Top 0.406: v30.16,41.59 32.41,41.59 J1.1
  Bottom 0.406: JP7.3 26.4,40.37 27.62,41.59 v30.16,41.59
P0  (via drill 0.38)
  Top 0.305: v27.94,12.06 IC4.13
  Bottom 0.305: JP4.11 17.6,6.49 18.73,7.62 26.99,7.62 27.94,8.57 v27.94,12.06
P1  (via drill 0.38)
  Top 0.305: v29.21,12.06 IC4.14
  Bottom 0.305: JP4.9 20.14,6.17 20.95,6.99 27.94,6.99 29.21,8.26 v29.21,12.06
P2
  Top 0.305: IC4.15 30.48,9.21 30.16,8.89 28.57,8.89 26.99,7.3 24.13,7.3 22.86,6.03 22.86,5.64 JP4.7
P3
  Top 0.305: IC4.16 31.75,8.89 31.11,8.26 28.89,8.26 27.3,6.67 26.04,6.67 25.4,6.03 25.4,5.64 JP4.5
P4
  Top 0.305: IC4.17 33.02,8.26 32.38,7.62 29.21,7.62 27.94,6.35 27.94,5.64 JP4.3
P5
  Top 0.305: IC4.18 34.29,7.94 33.34,6.99 31.11,6.99 30.48,6.35 30.48,5.64 JP4.1
PD6
  Top 0.305: IC4.12 26.67,8.57 26.04,7.94 23.5,7.94 22.54,6.99 16.19,6.99 15.24,6.03 15.24,5.64 JP4.13
PD7
  Top 0.305: IC4.11 25.4,9.21 24.77,8.57 23.18,8.57 22.23,7.62 13.97,7.62 12.7,6.35 12.7,5.64 JP4.15
PGC  (via drill 0.38)
  Top 0.152: v41.59,27.62 41.59,26.35 41.27,26.04 41.27,24.13 38.7,21.56 38.7,20.03 39.37,19.37 39.37,19.05 39.69,18.73 40.63,18.73 IC2.16 | v41.59,29.53 41.59,31.6 J2.5
  Bottom 0.152: v41.59,27.62 v41.59,29.53
PGD  (via drill 0.38)
  Top 0.152: IC2.17 42.05,17.93 42.23,18.1 42.23,21.91 41.59,22.54 41.59,25.72 42.86,26.99 v42.86,27.62 | v42.86,29.53 42.86,31.6 J2.4
  Bottom 0.152: v42.86,27.62 v42.86,29.53
RC0  (via drill 0.38)
  Top 0.152: IC4.6 27.94,16.51 29.84,14.61 v34.92,14.61 | IC2.32 49.63,13.23 48.26,14.61 v42.23,14.61
  Bottom 0.152: v34.92,14.61 v42.23,14.61
RC1  (via drill 0.38)
  Top 0.152: IC4.5 29.21,16.19 30.16,15.24 v35.88,15.24 | IC2.35 48.77,14.72 48.26,15.24 v43.18,15.24
  Bottom 0.152: v35.88,15.24 v43.18,15.24
RC2  (via drill 0.38)
  Top 0.152: IC4.4 30.48,16.51 31.11,15.88 v34.92,15.88 | IC2.36 48.93,15.53 48.58,15.88 v42.23,15.88
  Bottom 0.152: v34.92,15.88 v42.23,15.88
RC3  (via drill 0.38)
  Top 0.152: IC4.3 31.75,17.14 32.38,16.51 v35.88,16.51 | IC2.37 48.76,16.32 48.58,16.51 v43.18,16.51
  Bottom 0.152: v35.88,16.51 v43.18,16.51
RC4  (via drill 0.38)
  Top 0.152: v44.04,18.1 48.26,18.1 50.48,20.32 IC2.42 | IC4.2 33.02,19.05 33.66,18.41 35.88,18.41 v36.51,17.78
  Bottom 0.152: v44.04,18.1 40.32,18.1 40.01,17.78 v36.51,17.78
RC5  (via drill 0.38)
  Top 0.152: IC4.1 36.97,20.14 v37.15,20.32 | IC2.43 50.34,21.12 49.53,20.32 44.45,20.32 v43.81,20.95
  Bottom 0.152: v37.15,20.32 37.78,20.95 v43.81,20.95
RD0  (via drill 0.38)
  Top 0.152: IC2.38 53.68,17.12 58.74,12.06 59.69,12.06 JP2.17 | R6.1 57.47,9.21 v57.78,9.53
  Bottom 0.152: v57.78,9.53 59.69,11.43 59.69,11.9 JP2.17
RD1  (via drill 0.38)
  Top 0.152: IC2.39 55.42,17.93 58.74,14.61 59.69,14.61 JP2.15 | R7.1 v57.47,11.43
  Bottom 0.152: v57.47,11.43 57.47,13.02 58.74,14.29 59.54,14.29 JP2.15
RD2
  Top 0.152: IC2.40 57.16,18.73 58.74,17.14 59.69,17.14 JP2.13
RD3
  Top 0.152: IC2.41 59.7,19.52 JP2.11
RD4
  Top 0.152: IC2.2 49.63,22.75 49.85,22.54 59.37,22.54 59.69,22.23 JP2.9
RD5
  Top 0.152: IC2.3 48.84,24.7 49.21,25.08 59.37,25.08 59.69,24.77 JP2.7
RD6  (via drill 0.38)
  Top 0.152: JP2.5 59.69,27.3 57.78,25.4 48.58,25.4 48.03,24.86 IC2.4 48.03,22.45 v48.26,22.23 | v48.26,19.68 48.26,19.37 47.62,18.73 v44.77,18.73 | IC4.7 v26.67,17.78
  Bottom 0.152: v48.26,19.68 v48.26,22.23 | v44.77,18.73 40.01,18.73 39.69,18.41 27.3,18.41 v26.67,17.78
RD7  (via drill 0.38)
  Top 0.152: JP2.3 58.42,28.41 58.42,26.99 57.15,25.72 48.26,25.72 47.23,24.69 IC2.5 47.23,21.98 v47.31,21.91 | v47.31,19.68 46.99,19.37 v43.5,19.37 | IC4.8 v25.4,18.41
  Bottom 0.152: v47.31,19.68 v47.31,21.91 | v43.5,19.37 39.69,19.37 39.05,18.73 25.72,18.73 v25.4,18.41
RX  (via drill 0.38)
  Top 0.152: IC6.10 27.88,23.43 v28.26,23.81 | v33.66,23.81 34.29,23.18 39.37,23.18 v40.01,23.81 | IC2.1 51.19,23.73 v51.28,23.81
  Bottom 0.152: v28.26,23.81 v33.66,23.81 | v40.01,23.81 v51.28,23.81
TEMP  (via drill 0.38)
  Top 0.152: IC2.9 44.03,25.18 v43.81,25.4 | v37.15,26.04 35.88,26.04 35.24,25.4 IC3.2
  Bottom 0.152: v43.81,25.4 43.18,26.04 v37.15,26.04
TX  (via drill 0.38)
  Top 0.152: IC2.44 49.23,21.93 48.58,21.27 44.77,21.27 44.13,21.91 v43.5,21.91 | IC6.12 26.42,27.55 27.94,26.04 30.8,26.04 v31.11,25.72 | v38.1,21.91 37.78,21.91 36.83,20.95 35.5,20.95 34.54,21.91 34.29,21.91 33.02,23.18 33.02,25.5 v32.77,25.72
  Bottom 0.152: v31.11,25.72 v32.77,25.72 | v38.1,21.91 v43.5,21.91
VCC  (via drill 0.38)
  Top 0.152: R1.2 23.18,15.88 24.13,14.92 IC4.10
  Top 0.406: IC4.10 23.36,10.34 v22.86,9.84 | v1.59,32.38 1.59,33.02 2.54,33.97 8.89,33.97 v13.02,38.1
  Bottom 0.406: v22.86,9.84 18.73,9.84 16.19,6.67 16.19,3.24 16.51,2.92 | v1.59,32.38 1.59,13.34 2.54,12.38 4.49,12.38 X1.5 | v13.02,38.1 21.26,38.1 JP7.1
  Bottom 2.54: JP4.2 JP4.4 JP4.6 JP4.8 JP4.10 JP4.12 16.51,2.92 JP4.14 JP4.16 11.37,2.92 10.16,3.81 10.16,8.89 6.56,12.49 X1.5
VMETER
  Top 0.152: R2.2 9.53,9.53 7.94,11.11 7.94,15.24 6.99,16.19 X1.4
VOLT1  (via drill 0.38)
  Top 0.152: IC1.7 IC1.6 16.51,16.51 16.83,16.83 v27.3,16.83 | IC2.11 42.44,22.97 42.86,22.54 42.86,17.78 v43.18,17.46 | v34.92,17.46 33.34,17.46 v33.02,17.14
  Bottom 0.152: v27.3,16.83 32.7,16.83 v33.02,17.14 | v34.92,17.46 35.88,17.46 36.2,17.14 40.32,17.14 40.64,17.46 v43.18,17.46
VOLT2  (via drill 0.38)
  Top 0.152: IC1.1 IC1.2 15.24,11.75 v15.56,12.06 | IC2.14 39.38,20.32 v39.34,20.32 | v25.4,12.7 35.24,12.7 38.1,15.56 v38.1,19.37
  Bottom 0.152: v15.56,12.06 16.19,12.7 v25.4,12.7 | v39.34,20.32 39.05,20.32 v38.1,19.37

### Text on the board
Unrouted: PIC18F45K50 GELİŞTİRME KARTI | rev.1.03
tNames: 1 | ... | RD5 | RD4 | =Amp= | RD3 | RD2 | Gnd | v1.0 | RD1 | VM | RD0 | Vcc | JFD | 2k11 | RD7 | RD6 | RC0 | RC1 | RC2 | RC3 | RC4 | RC5 | 1 | AN0 | AN1 | AN2 | AN3 | ... | 1